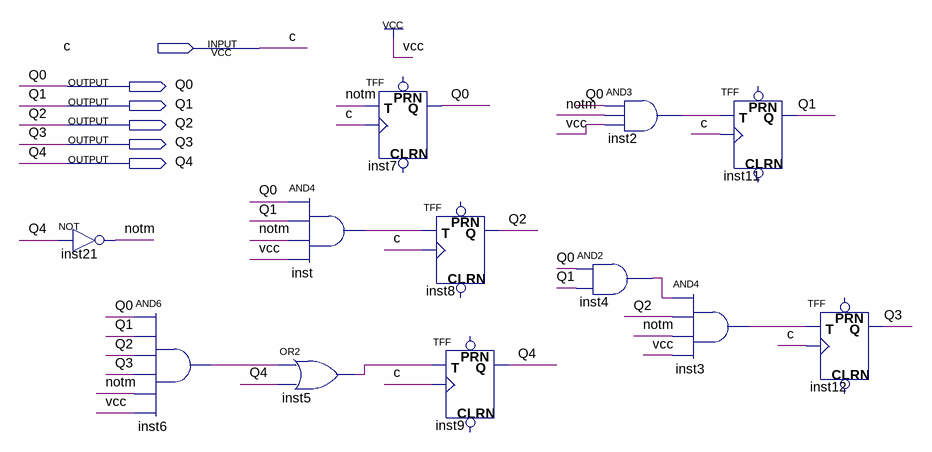
[diagram p0: schematic sheet]
// Quartus schematic lr3.bdf as structural Verilog: 12 symbols, 6 pins
module lr3 (
  input  c,
  output Q0,
  output Q1,
  output Q2,
  output Q3,
  output Q4
);

  wire inst2_out, inst3_out, inst4_out, inst5_out, inst6_out, inst_out, notm;

  not inst21 (notm, Q4);
  and inst6 (inst6_out, Q0, Q1, Q2, Q3, notm, 1'b1);
  and inst (inst_out, Q0, Q1, notm, 1'b1);
  or inst5 (inst5_out, inst6_out, Q4);
  TFF inst7 (.T(notm), .CLK(c), .Q(Q0));  // open: PRN, CLRN
  TFF inst8 (.T(inst_out), .CLK(c), .Q(Q2));  // open: PRN, CLRN
  TFF inst9 (.T(inst5_out), .CLK(c), .Q(Q4));  // open: PRN, CLRN
  and inst2 (inst2_out, Q0, notm, 1'b1);
  and inst4 (inst4_out, Q0, Q1);
  and inst3 (inst3_out, inst4_out, Q2, notm, 1'b1);
  TFF inst11 (.T(inst2_out), .CLK(c), .Q(Q1));  // open: PRN, CLRN
  TFF inst12 (.T(inst3_out), .CLK(c), .Q(Q3));  // open: PRN, CLRN
endmodule
